# EAGLE design Revised (EAGLE 6.4)
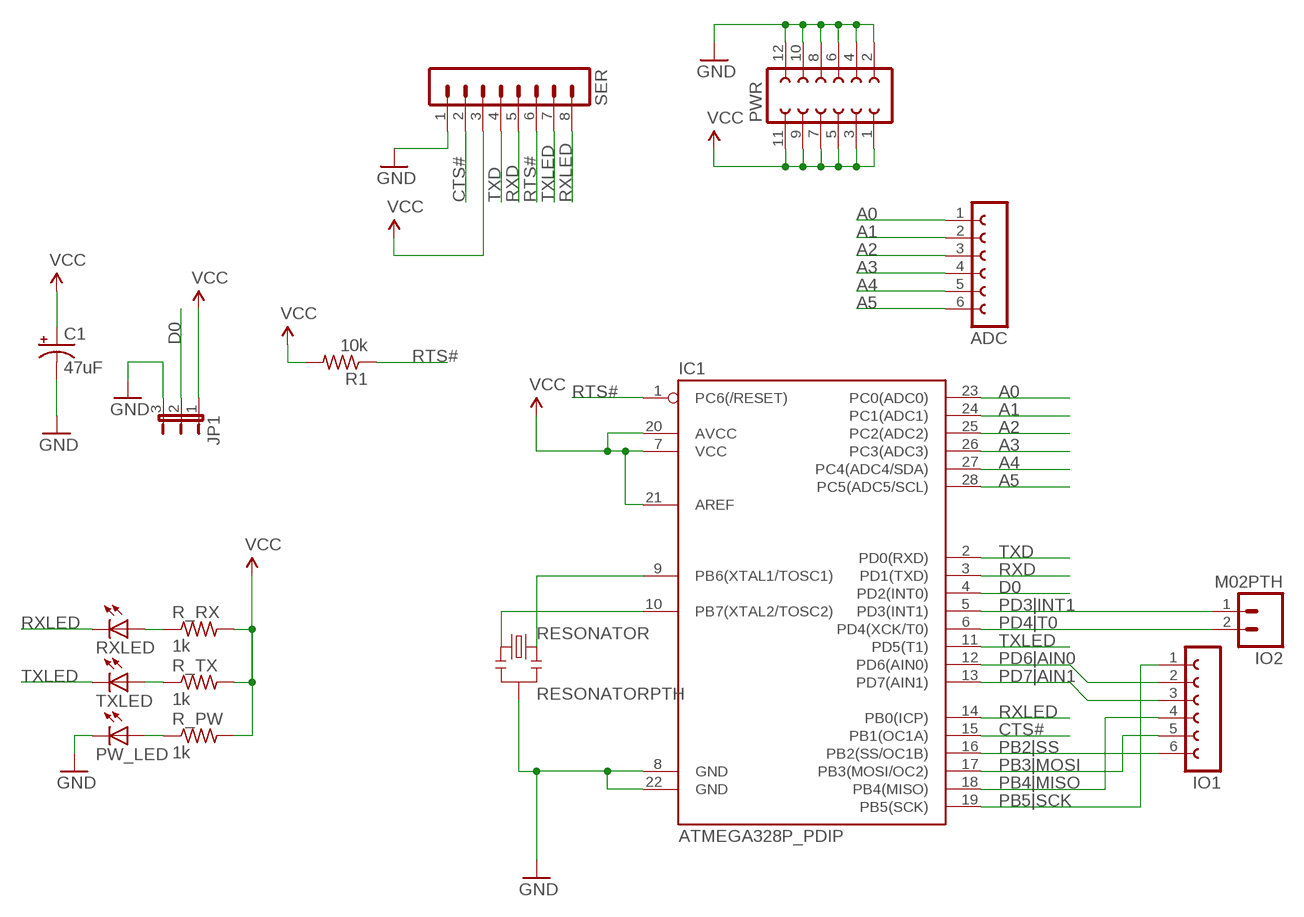
[diagram p0: schematic, sheet 1]

## Parts
ADC  FE06-1  [FE06]
C1  47uF  CPOL-USE2,5-6E  [E2,5-6E]
IC1  ATMEGA328P_PDIP  [DIL28-3]
IO1  FE06-1  [FE06]
IO2  M02PTH  [1X02]
JP1  JP2E  [JP2]
PW_LED  LED5MM  [LED5MM]
PWR  FE06-2  [FE06-2]
R1  10k  R-US_R0805  [R0805]
R_PW  1k  R-US_R0805  [R0805]
R_RX  1k  R-US_R0805  [R0805]
R_TX  1k  R-US_R0805  [R0805]
RESONATOR  RESONATORPTH  [RESONATOR-PTH]
RXLED  LED5MM  [LED5MM]
SER  MA08-1W  [MA08-1W]
TXLED  LED5MM  [LED5MM]

## Nets
A0: ADC.1 IC1.23(PC0(ADC0))
A1: ADC.2 IC1.24(PC1(ADC1))
A2: ADC.3 IC1.25(PC2(ADC2))
A3: ADC.4 IC1.26(PC3(ADC3))
A4: ADC.5 IC1.27(PC4(ADC4/SDA))
A5: ADC.6 IC1.28(PC5(ADC5/SCL))
CTS#: IC1.15(PB1(OC1A)) SER.2
D0: IC1.4(PD2(INT0)) JP1.2
GND [gnd]: C1.- IC1.8(GND) IC1.22(GND) JP1.3 PW_LED.K(C) PWR.2 PWR.4 PWR.6 PWR.8 PWR.10 PWR.12 RESONATOR.2 SER.1
N$1: IC1.9(PB6(XTAL1/TOSC1)) RESONATOR.3
N$2: IC1.10(PB7(XTAL2/TOSC2)) RESONATOR.1
N$4: R_TX.1 TXLED.A
N$5: R_RX.1 RXLED.A
N$6: PW_LED.A R_PW.1
PB2|SS: IC1.16(PB2(SS/OC1B)) IO1.6
PB3|MOSI: IC1.17(PB3(MOSI/OC2)) IO1.5
PB4|MISO: IC1.18(PB4(MISO)) IO1.4
PB5|SCK: IC1.19(PB5(SCK)) IO1.1
PD3|INT1: IC1.5(PD3(INT1)) IO2.1
PD4|T0: IC1.6(PD4(XCK/T0)) IO2.2
PD6|AIN0: IC1.12(PD6(AIN0)) IO1.2
PD7|AIN1: IC1.13(PD7(AIN1)) IO1.3
RTS#: IC1.1(PC6(/RESET)) R1.1 SER.6
RXD: IC1.3(PD1(TXD)) SER.5
RXLED: IC1.14(PB0(ICP)) RXLED.K(C) SER.8
TXD: IC1.2(PD0(RXD)) SER.4
TXLED: IC1.11(PD5(T1)) SER.7 TXLED.K(C)
VCC [power]: C1.+ IC1.7(VCC) IC1.20(AVCC) IC1.21(AREF) JP1.1 PWR.1 PWR.3 PWR.5 PWR.7 PWR.9 PWR.11 R1.2 R_PW.2 R_RX.2 R_TX.2 SER.3

## Library data of the parts
ADC IO1 = con-lsta:FE06-1: FEMALE HEADER; OC_FARNELL: unknown; OC_NEWARK: unknown
C1 = rcl:CPOL-US: POLARIZED CAPACITOR, American symbol
IC1 = SparkFun-DigitalIC:ATMEGA328P_PDIP: uC used in the Arduino 32kb flash, 1k EEPROM, 2k SRAM This is the through-hole version of this chip.
IO2 = SparkFun-Connectors:M02: Standard 2-pin 0.1" header. Use with - straight break away headers ( PRT-00116) - right angle break away headers (PRT-00553) - swiss pins (PRT-00743) - machine pins (PRT-00117) - female headers (PRT-00115) Molex polarized connector foot print use with: PRT-08233 with associated crimp pins and housings. 2.54_SCREWTERM for use with PRT-10571. 3.5mm Screw Terminal footprints for PRT-08084 5mm Screw Terminal footprints for use with PRT-08433
JP1 = jumper:JP2E: JUMPER
PW_LED RXLED TXLED = SparkFun-LED:LED: LEDs Standard schematic elements and footprints for 5mm, 3mm, 1206, and 0603 sized LEDs. 5mm - Spark Fun Electronics SKU : COM-00529 (and others)
PWR = con-lsta:FE06-2: FEMALE HEADER; OC_FARNELL: unknown; OC_NEWARK: unknown
R1 R_PW R_RX R_TX = rcl:R-US_: RESISTOR, American symbol
RESONATOR = SparkFun-FreqCtrl:RESONATOR: Resonator Small SMD resonator. Used, eg, on the Arduino Pro/ Pro Mini boards. 8MHz- XTAL-08895 16MHz- XTAL-08900
SER = con-lstb:MA08-1W: PIN HEADER; OC_FARNELL: unknown; OC_NEWARK: unknown

## Net classes
1 power: width 0.813 mm
2 gnd: width 0.406 mm

## Board
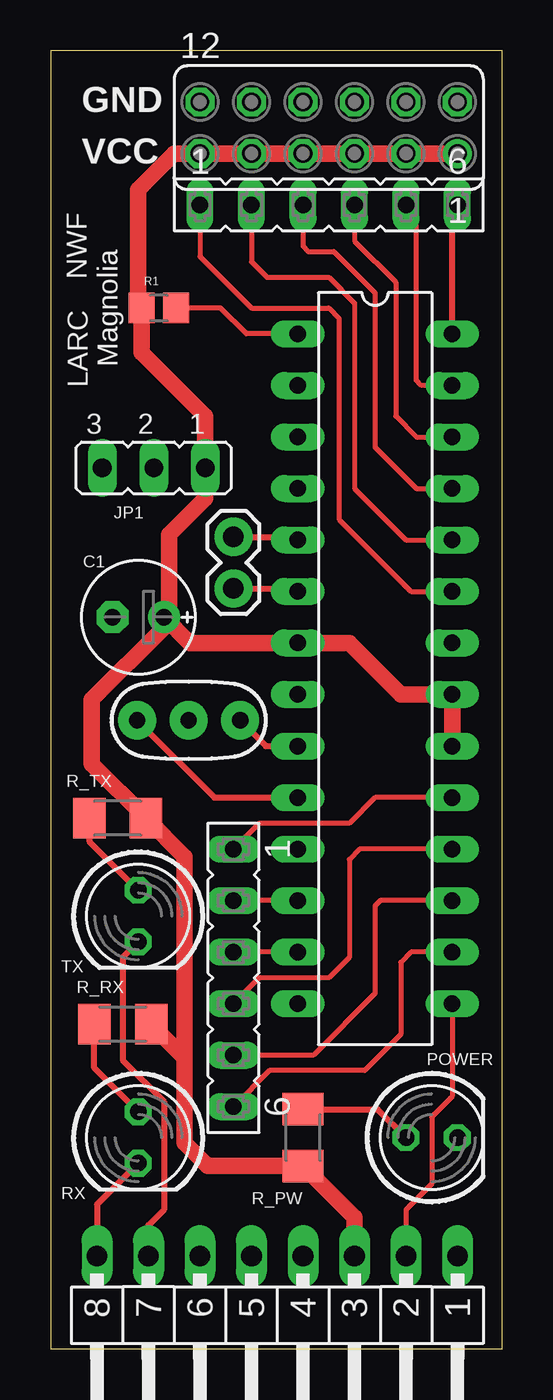
[diagram p1: board, top side]
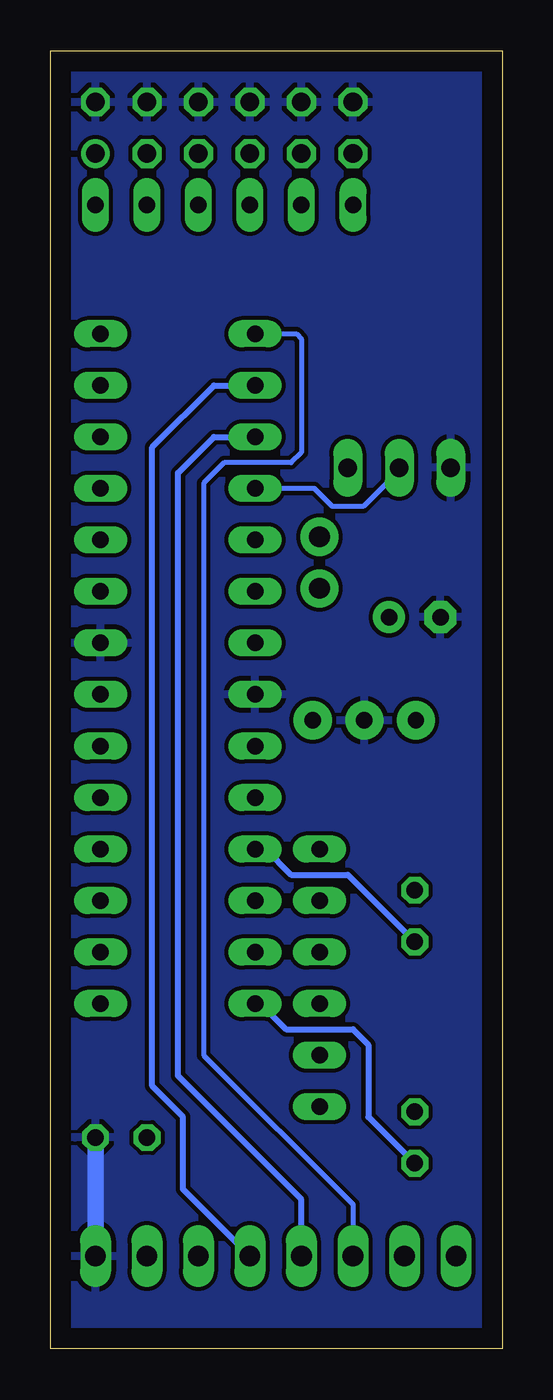
[diagram p2: board, bottom side, seen from below]

Size 22.28 x 64 mm. Coordinates in mm from the lower left corner, seen from the top.
Outline: 0,0 22.28,0 22.28,64 0,64 0,0
Copper layers (1*16): Top 0.035mm / dielectric 1.5mm / Bottom 0.035mm
Design rules "default *": minimum track width 10mil, minimum drill 24mil, track to track 8mil, track to pad 8mil, pad to pad 8mil, via to via 8mil, smd to smd 8mil, copper to edge 40mil, drill to drill 8mil, minimum pad ring 10mil, minimum via ring 8mil, stop-mask expansion 4mil, vias tented up to drill 0mil, thermal gap 10mil

### Footprints (pad centres in the part's own frame; a part is rotated, then mirrored left to right if it is on the bottom)
FE06 = drill 0.813 long: 1 -6.35,0; 2 -3.81,0; 3 -1.27,0; 4 1.27,0; 5 3.81,0; 6 6.35,0
E2,5-6E = drill 0.813 pad 1.575: + -1.27,0 | drill 0.813 pad 1.575 octagon: - 1.27,0
DIL28-3 = drill 0.813 long: 1 -16.51,-3.81; 2 -13.97,-3.81; 3 -11.43,-3.81; 4 -8.89,-3.81; 5 -6.35,-3.81; 6 -3.81,-3.81; 7 -1.27,-3.81; 8 1.27,-3.81; 9 3.81,-3.81; 10 6.35,-3.81; 11 8.89,-3.81; 12 11.43,-3.81; 13 13.97,-3.81; 14 16.51,-3.81; 15 16.51,3.81; 16 13.97,3.81; 17 11.43,3.81; 18 8.89,3.81; 19 6.35,3.81; 20 3.81,3.81; 21 1.27,3.81; 22 -1.27,3.81; 23 -3.81,3.81; 24 -6.35,3.81; 25 -8.89,3.81; 26 -11.43,3.81; 27 -13.97,3.81; 28 -16.51,3.81
1X02 = drill 1.016 pad 1.88: 1 0,0; 2 2.54,0
JP2 = drill 0.914 long: 1 -2.54,0; 2 0,0; 3 2.54,0
LED5MM = drill 0.813 octagon: A -1.27,0; K 1.27,0
FE06-2 = drill 0.914: 1 -6.35,1.27 | drill 0.914 octagon: 2 -6.35,-1.27; 3 -3.81,1.27; 4 -3.81,-1.27; 5 -1.27,1.27; 6 -1.27,-1.27; 7 1.27,1.27; 8 1.27,-1.27; 9 3.81,1.27; 10 3.81,-1.27; 11 6.35,1.27; 12 6.35,-1.27
R0805 = smd 1.3 x 1.5: 1 -0.85,0; 2 0.85,0
M3216 = smd 1.6 x 2: 1 -1.4,0; 2 1.4,0
RESONATOR-PTH = drill 0.8 pad 1.88: 1 -2.54,0; 2 0,0; 3 2.54,0
MA08-1W = drill 1.016 long: 1 -8.89,0; 2 -6.35,0; 3 -3.81,0; 4 -1.27,0; 5 1.27,0; 6 3.81,0; 7 6.35,0; 8 8.89,0

### Placement (x,y rotation side)
ADC  13.72,56.39 0 top
C1  4.32,36.07 180 top
IC1  16,33.53 270 top
IO1  9.02,18.29 270 top
IO2  9.02,40.03 270 top
JP1  5.08,43.43 180 top
PW_LED  18.8,10.41 0 top
PWR  13.72,60.2 180 top
R1  5.33,51.31 180 top
R_PW  1k  [M3216]  12.45,10.41 270 top
R_RX  1k  [M3216]  3.56,16 0 top
R_TX  1k  [M3216]  3.3,26.16 0 top
RESONATOR  6.81,30.99 0 top
RXLED  4.32,10.41 270 top
SER  11.18,4.57 180 top
TXLED  4.32,21.34 270 top

### Tracks (layer width: path | path; a pad name or v marks a point on that pad's centre or on a via)
A0
  Top 0.254: ADC.1 7.37,53.85 9.91,51.31 13.72,51.31 14.22,50.8 14.22,40.89 17.78,37.34 IC1.23
A1
  Top 0.254: ADC.2 9.91,53.59 10.67,52.83 13.72,52.83 14.99,51.56 14.99,42.42 17.53,39.88 IC1.24
A2
  Top 0.254: ADC.3 12.45,54.36 12.7,54.1 13.97,54.1 16,52.07 16,44.45 18.03,42.42 IC1.25
A3
  Top 0.254: ADC.4 14.99,54.61 17.02,52.58 17.02,45.97 18.03,44.96 IC1.26
A4
  Top 0.254: IC1.27 18.29,47.5 18.03,47.75 18.03,55.88 ADC.5
A5
  Top 0.305: IC1.28 19.81,56.13 ADC.6
CTS#
  Top 0.254: IC1.15 19.81,12.45 18.8,11.43 18.8,8.13 17.53,6.86 SER.2
D0
  Bottom 0.254: IC1.4 9.27,42.42 8.38,41.53 6.86,41.53 5.08,43.31 JP1.2
GND
  Bottom 0.813: SER.1 PW_LED.K
  pour Bottom: 0.25,63.75 22.1,63.75 22.1,0.25 0.25,0.25
N$1
  Top 0.305: RESONATOR.3 10.62,29.72 IC1.9
N$2
  Top 0.305: RESONATOR.1 8.08,27.18 IC1.10
N$4
  Top 0.305: R_TX.1 1.9,25.02 TXLED.A
N$5
  Top 0.305: RXLED.A 2.16,13.85 R_RX.1
N$6
  Top 0.305: R_PW.1 16.13,11.81 PW_LED.A
PB2|SS
  Top 0.254: IC1.16 17.78,19.56 17.27,19.05 17.27,15.49 15.49,13.72 10.79,13.72 IO1.6
PB3|MOSI
  Top 0.254: IC1.17 16.26,22.1 16,21.84 16,17.53 12.95,14.48 IO1.5
PB4|MISO
  Top 0.254: IC1.18 15.24,24.64 14.73,24.13 14.73,19.3 13.72,18.29 10.29,18.29 IO1.4
PB5|SCK
  Top 0.254: IC1.19 16,27.18 14.73,25.91 10.29,25.91 IO1.1
PD3|INT1
  Top 0.305: IO2.1 12.04,40.03 IC1.5
PD4|T0
  Top 0.305: IO2.2 12.04,37.49 IC1.6
PD6|AIN0
  Top 0.254: IC1.12 IO1.2
PD7|AIN1
  Top 0.254: IC1.13 IO1.3
RTS#
  Top 0.254: IC1.1 9.65,50.04 8.38,51.31 R1.1
  Bottom 0.254: IC1.1 10.16,50.04 9.91,49.78 9.91,44.2 10.41,43.69 13.72,43.69 14.73,42.67 14.73,14.48 7.37,7.11 SER.6
RXD
  Bottom 0.305: SER.5 9.91,7.37 16,13.46 16,43.18 14.22,44.96 IC1.3
RXLED
  Top 0.305: RXLED.K 2.29,7.11 SER.8
  Bottom 0.305: IC1.14 11.94,17.02 10.67,15.75 7.37,15.75 6.6,14.99 6.6,11.43 RXLED.K
TXD
  Bottom 0.305: SER.4 15.75,7.87 15.75,11.43 17.27,12.95 17.27,44.45 14.22,47.5 IC1.2
TXLED
  Top 0.305: TXLED.K 3.56,19.3 3.56,14.22 5.59,12.19 5.59,6.86 4.83,6.1 SER.7
  Bottom 0.305: IC1.11 11.68,24.64 10.41,23.37 7.62,23.37 TXLED.K
VCC
  Top 0.813: PWR.1 PWR.3 PWR.5 PWR.7 PWR.9 PWR.11 6.1,58.93 4.32,57.15 4.32,51.47 R1.2 4.48,49.11 7.62,45.97 JP1.1 7.62,41.91 5.84,40.13 5.84,36.07 C1.+ | SER.3 14.99,6.47 R_PW.2 7.75,9.01 6.6,10.16 6.6,14.35 | IC1.20 IC1.21 17.27,32.26 14.73,34.8 IC1.7 6.86,34.8 C1.+ | 6.6,14.35 R_RX.2 | C1.+ 5.59,35.56 2.03,32 2.03,28.83 R_TX.2 6.6,24.26 6.6,14.35

### Text on the board
tNames: TX | POWER | RX
_tsilk: GND | VCC | Magnolia | NWF | LARC